# EasyEDA Pro project IOX_77_easyEDA_proj_2026-04-07.epro, board PCB1
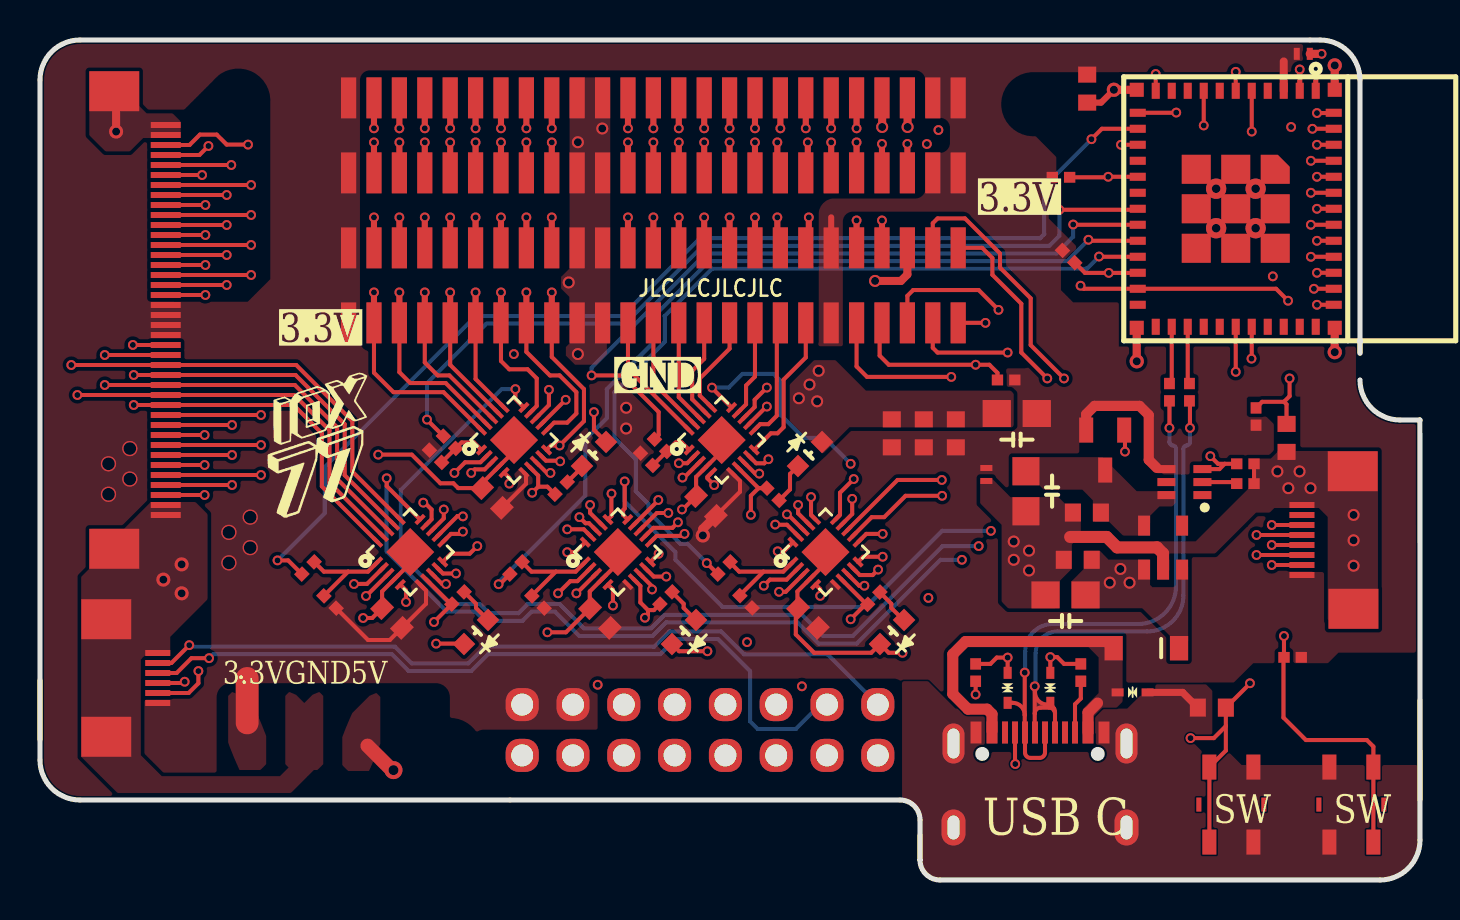
[diagram p1: board, top side]
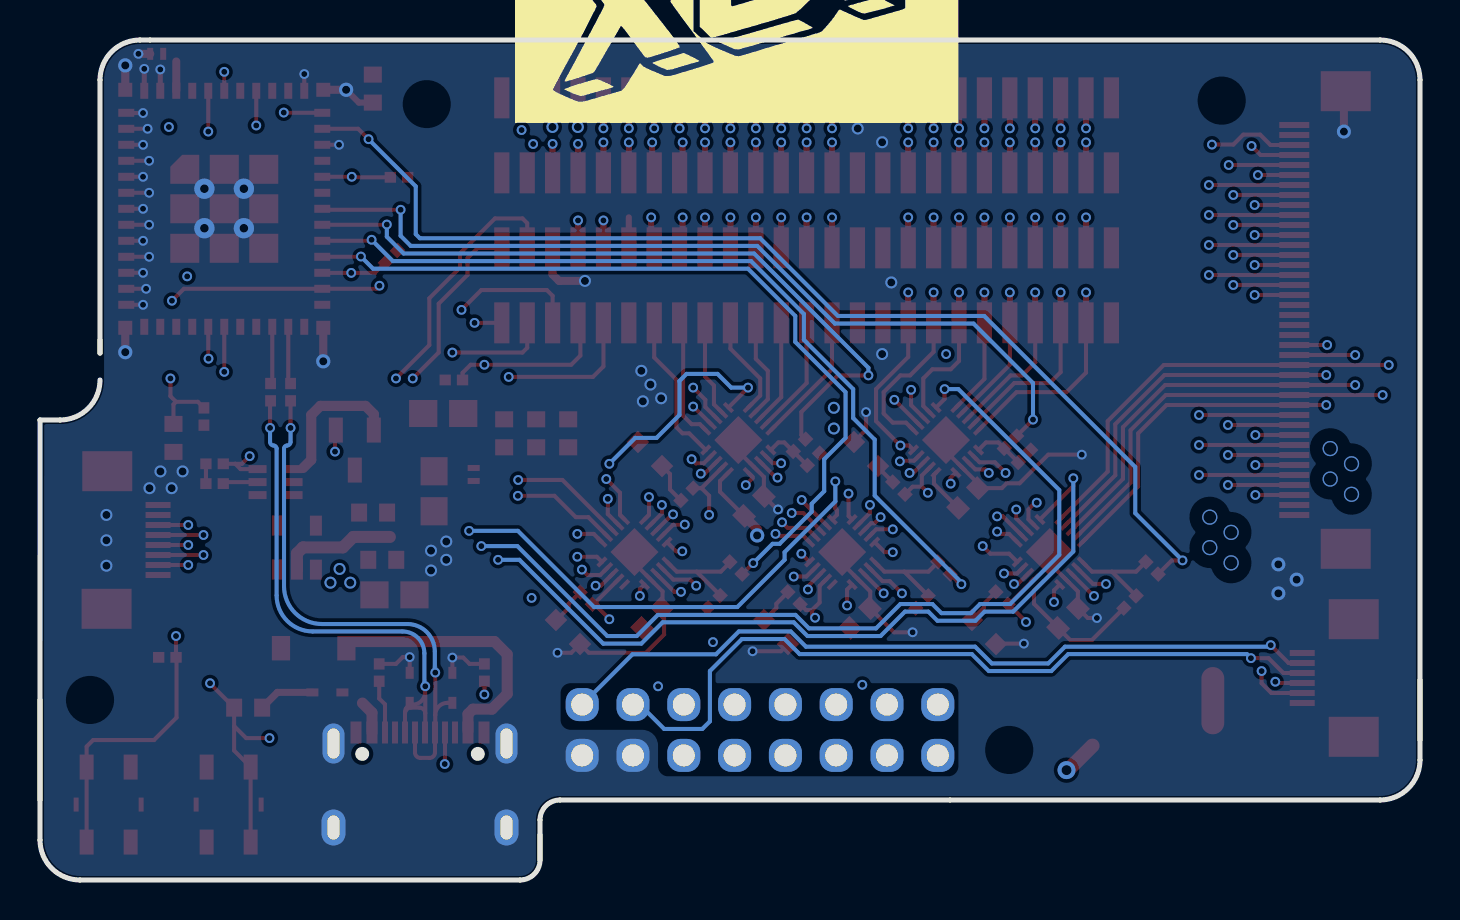
[diagram p2: board, bottom side, seen from below]

Outline 69 x 42 mm; copper layers: Top Layer, Inner1, Inner2, Bottom Layer. Coordinates in mm from the lower left corner of the outline.
Outline path: 0,7 0,10 ; 44,1 44,3 arc(43.71,3.71) 43,4 2,4 arc(0.59,4.59) 0,6 0,40 arc(0.59,41.41) 2,42 64,42 arc(65.41,41.41) 66,40 66,26.35 66,27 ; 44,1 44,2.26 ; 44,1 arc(44.29,0.29) 45,0 67,0 arc(68.41,0.59) 69,2 69,9 ; 66,25 arc(66.59,23.59) 68,23 68.99,23 ; 68.99,23 arc(69,23) 69,22.99 ; 68.99,23 69,4
Stack: Top Layer 0.035mm Outer layer thickness 1oz / Dielectric1 0.2104mm 7628 RC49% 8.6mil / Inner1 0.0152mm Inner layer thickness / Dielectric2 1.065mm 1.1mm H/HOZ Copper / Inner2 0.0152mm Inner layer thickness / Dielectric3 0.2104mm 7628 RC49% 8.6mil / Bottom Layer 0.035mm Outer layer thickness 1oz

## Design rules (mm)
template: Custom Config
spacing copperThickness1oz (default): track to track 0.102, other pairs 0.152 to 0.3
spacing copperThickness2oz: track to track 0.203, other pairs 0.152 to 0.3
track width copperThickness1oz (default): min 0.127, default 0.203, max 2.54
track width copperThickness2oz: min 0.203, default 0.305, max 2.54
differential pair differentialPair (default): width min 0.127, default 0.254, max 2.54; gap min 0.152, default 0.152
via viaSize (default): diameter min 0.45, default 0.49, max 10; hole min 0.3, default 0.3, max 6.3
pour e8095 uses copperRegion2

## Placement (name value [footprint] x y rotation side)
C1  100nF  [0603 CAP clean]  62.33 22.11 270 top
C2  10nF  [0603 CAP clean]  45.79 22.33 90 top
C3  1uF  [0603 CAP clean]  44.19 22.33 90 top
C4  10uF  [C0805]  48.84 23.32 180 top
C5  100nF  [0603 CAP clean]  42.59 22.33 90 top
C20  100nF  [0603 CAP clean]  58.59 8.62 180 top
C22  100nF  [0603 CAP clean]  17.6 13.1 135 top
C23  100nF  [0603 CAP clean]  22.6 19.1 135 top
C24  100nF  [0603 CAP clean]  28 13.1 135 top
C25  100nF  [0603 CAP clean]  38.4 13.1 135 top
C26  100nF  [0603 CAP clean]  33.3 18.7 135 top
C27  100nF  [0603 CAP clean]  51.89 16.01 180 top
C28  10uF  [C0805]  51.28 14.26 180 top
C29  100nF  [0603 CAP clean]  52.34 18.37 180 top
C30  10uF  [C0805]  49.3 19.44 270 top
C31  100nF  [0603 CAP clean]  52.36 39.57 270 top
D1  LESD8D3.3CAT5G  [SOD-882_L1.0-W0.6-BI]  47.32 20.28 90 top
D3  1N5819HW-7-F  [SOD-123_L2.7-W1.6-LS3.7-RD]  55.32 11.59 180 top
D4  LESD8D3.3CAT5G  [SOD-882_L1.0-W0.6-BI]  63.16 41.31 180 top
FPC1  FPC-05F-8PH20  [FPC-SMD_8P-P0.50_FPC-05F-8PH20]  64.38 17 90 top
FPC2  FPC-05F-6PH20  [FPC-SMD_6P-P0.50_XUNPU_FPC-05F-6PH20]  4.6 10.1 270 top
FPC3  FPC-05F-40PH20  [FPC-SMD_40P-P0.50_FPC-05F-40PH20]  5 28 270 top
H3  -  [ESPIO 2x8 clean]  33 7.5 0 top
LED2  XL-1608UOC-06  [ESPIO 0603 LED clean]  21.8 12.4 45 top
LED3  XL-1608UOC-06  [ESPIO 0603 LED clean]  27.7 21.3 225 top
LED4  XL-1608UOC-06  [ESPIO 0603 LED clean]  32.2 12.4 45 top
LED5  XL-1608UOC-06  [ESPIO 0603 LED clean]  42.6 12.4 45 top
LED6  XL-1608UOC-06  [ESPIO 0603 LED clean]  38.5 21.3 225 top
Q14  SI2393DS-T1-GE3  [SOT-23-3_L2.9-W1.3-P1.90-LS2.4-BR]  53.26 21.5 90 top
R4  10K  [R0402]  60.8 23.17 270 top
R5  5.1K  [R0402]  46.78 10.37 270 top
R6  5.1K  [R0402]  52.04 10.37 270 top
R7  22  [R0402]  56.47 24.39 270 top
R8  22  [R0402]  57.47 24.39 270 top
R17  10K  [R0402]  62.63 11.13 0 top
R18  10K  [R0402]  48.31 25 0 top
R19  10K  [R0402]  51.05 35.14 180 top
R20  10K  [R0402]  51.43 31.17 135 top
R24  1K  [R0402]  13.4 15.6 225 top
R25  10K  [R0402]  14.5 13.9 315 top
R26  1K  [R0402]  20.9 14.1 225 top
R27  1K  [R0402]  20.48 21.89 135 top
R28  10K  [R0402]  19.78 21.19 135 top
R29  1K  [R0402]  26.06 19.59 225 top
R30  1K  [R0402]  23.8 15.6 225 top
R31  10K  [R0402]  24.9 13.9 315 top
R32  1K  [R0402]  31.3 14.1 225 top
R33  1K  [R0402]  34.2 15.6 225 top
R34  10K  [R0402]  35.3 13.91 315 top
R35  1K  [R0402]  41.69 14.09 225 top
R36  1K  [R0402]  31.03 21.73 135 top
R37  10K  [R0402]  30.33 21.03 135 top
R38  1K  [R0402]  36.65 19.29 135 top
R44  500K  [R0402]  60.27 20.81 180 top
R45  100K  [R0402]  60.27 19.82 180 top
SW1  TS-1075S-A1B2-D4  [SW-SMD_4P-L3.1-W3.1-P2.20-LS4.0]  59.57 3.77 90 top
SW2  TS-1075S-A1B2-D4  [SW-SMD_4P-L3.1-W3.1-P2.20-LS4.0]  65.57 3.77 90 top
U1  ESP32-C3-MINI-1-N4  [WIFIM-SMD_ESP32-C3-MINI-1]  59.79 33.56 270 top
U2  LESD5D5.0CT1G  [SOD-523_L1.2-W0.8-LS1.6-BI]  54.63 9.38 180 top
U3  LESD5D5.0CT1G  [SOD-523_L1.2-W0.8-LS1.6-BI]  50.52 9.61 270 top
U4  LESD5D5.0CT1G  [SOD-523_L1.2-W0.8-LS1.6-BI]  48.38 9.61 270 top
U8  HC-PM127-4.3H-2x25PS  [HDR-SMD_50P-P1.27-V-F-R2-C25-LS4.8]  30.67 37.23 0 top
U9  HC-PM127-4.3H-2x25PS  [HDR-SMD_50P-P1.27-V-F-R2-C25-LS4.8]  30.67 29.73 0 top
U13  TLV75733PDBVR  [SOT-23-5_L2.9-W1.6-P0.95-LS2.8-BL]  56.15 16.62 0 top
U14  DZDH0401DW-7  [SOT-363_L2.0-W1.3-P0.65-LS2.1-BR]  57.22 19.9 0 top
U.A1  CH32V003F4U6  [QFN-20_L3.0-W3.0-P0.40-TL-EP1.7]  18.51 16.4 45 top
U.A2  CH32V003F4U6  [QFN-20_L3.0-W3.0-P0.40-TL-EP1.7]  23.7 22 45 top
U.A3  CH32V003F4U6  [QFN-20_L3.0-W3.0-P0.40-TL-EP1.7]  28.89 16.4 45 top
U.A4  CH32V003F4U6  [QFN-20_L3.0-W3.0-P0.40-TL-EP1.7]  39.27 16.4 45 top
U.A5  CH32V003F4U6  [QFN-20_L3.0-W3.0-P0.40-TL-EP1.7]  34.08 22 45 top
USB1  TYPE-C 16PIN 2MD(073)  [USB-C-SMD_TYPE-C-6PIN-2MD-073]  50 5 0 top

## Footprints (pads in the part's own frame, mm; a bottom-side part is the same pattern mirrored in y, then rotated)
0603 CAP clean
  rect 0.8x0.9 smd: 1(-0.7,0) 2(0.7,0)
C0805
  rect 1.41x1.35 smd: 1(-1,0) 2(1,0)
ESPIO 2x8 clean
  rrect 1.65x1.65 hole 1.1: 1(-8.89,-1.27) 2(-8.89,1.27) 3(-6.35,-1.27) 4(-6.35,1.27) 5(-3.81,-1.27) 6(-3.81,1.27) 7(-1.27,-1.27) 8(-1.27,1.27) 9(1.27,-1.27) 10(1.27,1.27) 11(3.81,-1.27) 12(3.81,1.27) 13(6.35,-1.27) 14(6.35,1.27) 15(8.89,-1.27) 16(8.89,1.27)
ESPIO 0603 LED clean
  rect 0.8x0.8 smd: 1(0.851,0) 2(-0.851,0)
FPC-SMD_6P-P0.50_XUNPU_FPC-05F-6PH20
  rect 0.3x1.25 smd: 1(-1.25,1.288) 2(-0.75,1.288) 3(-0.25,1.288) 4(0.25,1.288) 5(0.75,1.288) 6(1.25,1.288)
  rect 2x2.5 smd: 7(2.94,-1.288) 8(-2.94,-1.288)
FPC-SMD_8P-P0.50_FPC-05F-8PH20
  rect 0.3x1.25 smd: 1(-1.75,1.288) 2(-1.25,1.288) 3(-0.75,1.288) 4(-0.25,1.288) 5(0.25,1.288) 6(0.75,1.288) 7(1.25,1.288) 8(1.75,1.288)
  rect 2x2.5 smd: 9(3.44,-1.252) 10(-3.44,-1.288)
FPC-SMD_40P-P0.50_FPC-05F-40PH20
  rect 0.3x1.5 smd: 1(-9.75,1.288) 2(-9.25,1.288) 3(-8.75,1.288) 4(-8.25,1.288) 5(-7.75,1.288) 6(-7.25,1.288) 7(-6.75,1.288) 8(-6.25,1.288) 9(-5.75,1.288) 10(-5.25,1.288) 11(-4.75,1.288) 12(-4.25,1.288) 13(-3.75,1.288) 14(-3.25,1.288) 15(-2.75,1.288) 16(-2.25,1.288) 17(-1.75,1.288) 18(-1.25,1.288) 19(-0.75,1.288) 20(-0.25,1.288) 21(0.25,1.288) 22(0.75,1.288) 23(1.25,1.288) 24(1.75,1.288) 25(2.25,1.288) 26(2.75,1.288) 27(3.25,1.288) 28(3.75,1.288) 29(4.25,1.288) 30(4.75,1.288) 31(5.25,1.288) 32(5.75,1.288) 33(6.25,1.288) 34(6.75,1.288) 35(7.25,1.288) 36(7.75,1.288) 37(8.25,1.288) 38(8.75,1.288) 39(9.25,1.288) 40(9.75,1.288)
  rect 2x2.5 smd: 41(11.44,-1.288) 42(-11.44,-1.288)
HDR-SMD_50P-P1.27-V-F-R2-C25-LS4.8
  rect 0.76x2.05 smd: 1(-15.24,-1.875) 2(-15.24,1.875) 3(-13.97,-1.875) 4(-13.97,1.875) 5(-12.7,-1.875) 6(-12.7,1.875) 7(-11.43,-1.875) 8(-11.43,1.875) 9(-10.16,-1.875) 10(-10.16,1.875) 11(-8.89,-1.875) 12(-8.89,1.875) 13(-7.62,-1.875) 14(-7.62,1.875) 15(-6.35,-1.875) 16(-6.35,1.875) 17(-5.08,-1.875) 18(-5.08,1.875) 19(-3.81,-1.875) 20(-3.81,1.875) 21(-2.54,-1.875) 22(-2.54,1.875) 23(-1.27,-1.875) 24(-1.27,1.875) 25(0,-1.875) 26(0,1.875) 27(1.27,-1.875) 28(1.27,1.875) 29(2.54,-1.875) 30(2.54,1.875) 31(3.81,-1.875) 32(3.81,1.875) 33(5.08,-1.875) 34(5.08,1.875) 35(6.35,-1.875) 36(6.35,1.875) 37(7.62,-1.875) 38(7.62,1.875) 39(8.89,-1.875) 40(8.89,1.875) 41(10.16,-1.875) 42(10.16,1.875) 43(11.43,-1.875) 44(11.43,1.875) 45(12.7,-1.875) 46(12.7,1.875) 47(13.97,-1.875) 48(13.97,1.875) 49(15.24,-1.875) 50(15.24,1.875)
QFN-20_L3.0-W3.0-P0.40-TL-EP1.7
  rect 0.6x0.2 smd: 1(-1.5,0.8) 2(-1.5,0.401) 3(-1.5,0) 4(-1.5,-0.4) 5(-1.5,-0.8) 11(1.5,-0.8) 12(1.5,-0.4) 13(1.5,0) 14(1.5,0.401) 15(1.5,0.8)
  rect 0.2x0.6 smd: 6(-0.8,-1.5) 7(-0.4,-1.5) 8(0,-1.5) 9(0.4,-1.5) 10(0.799,-1.5) 16(0.8,1.5) 17(0.4,1.5) 18(0,1.5) 19(-0.4,1.5) 20(-0.8,1.5)
  rect 1.7x1.7 smd: 21(0,0)
R0402
  rect 0.566x0.54 smd: 1(-0.433,0) 2(0.433,0)
SOD-123_L2.7-W1.6-LS3.7-RD
  rect 0.91x1.22 smd: 1(-1.635,0) 2(1.635,0)
SOD-523_L1.2-W0.8-LS1.6-BI
  rect 0.6x0.4 smd: 1(-0.75,0) 2(0.75,0)
SOD-882_L1.0-W0.6-BI
  rect 0.3x0.6 smd: 1(-0.325,0) 2(0.325,0)
SOT-23-3_L2.9-W1.3-P1.90-LS2.4-BR
  rect 1.25x0.7 smd: 1(1,-0.95) 2(1,0.95) 3(-1,0)
SOT-23-5_L2.9-W1.6-P0.95-LS2.8-BL
  rect 0.6x1 smd: 1(-0.95,-1.1) 2(0,-1.1) 3(0.95,-1.1) 4(0.95,1.1) 5(-0.95,1.1)
SOT-363_L2.0-W1.3-P0.65-LS2.1-BR
  rect 0.9x0.4 smd: 1(0.9,-0.65) 2(0.9,0) 3(0.9,0.65) 4(-0.9,0.65) 5(-0.9,0) 6(-0.9,-0.65)
SW-SMD_4P-L3.1-W3.1-P2.20-LS4.0
  rect 1.25x0.7 smd: 1(-1.875,1.1) 2(1.875,1.1) 3(-1.875,-1.1) 4(1.875,-1.1)
  rect 0.7x0.25 smd: 5(0,-1.625) 6(0,1.625)
USB-C-SMD_TYPE-C-6PIN-2MD-073
  rect 0.55x1.1 smd: 1(-3.2,2.375) 2(-2.4,2.375) 11(2.4,2.375) 12(3.2,2.375)
  rect 0.3x1.1 smd: 3(-1.75,2.375) 4(-1.25,2.375) 5(-0.75,2.375) 6(-0.25,2.375) 7(0.25,2.375) 8(0.75,2.375) 9(1.25,2.375) 10(1.75,2.375)
  oval 1.1x2 hole 0.6x1.5: 13(-4.325,1.825) 14(4.325,1.825)
  oval 1.2x1.8 hole 0.6x1.2: 13(-4.325,-2.375) 14(4.325,-2.375)
WIFIM-SMD_ESP32-C3-MINI-1
  rect 0.8x0.4 smd: 1(-5.9,4) 2(-5.9,3.2) 3(-5.9,2.4) 4(-5.9,1.6) 5(-5.9,0.8) 6(-5.9,0) 7(-5.9,-0.8) 8(-5.9,-1.6) 9(-5.9,-2.4) 10(-5.9,-3.2) 11(-5.9,-4) 25(5.9,-4) 26(5.9,-3.2) 27(5.9,-2.4) 28(5.9,-1.6) 29(5.9,-0.8) 30(5.9,0) 31(5.9,0.8) 32(5.9,1.6) 33(5.9,2.4) 34(5.9,3.2) 35(5.9,4)
  rect 0.4x0.8 smd: 12(-4.8,-4.9) 13(-4,-4.9) 14(-3.2,-4.9) 15(-2.4,-4.9) 16(-1.6,-4.9) 17(-0.8,-4.9) 18(0,-4.9) 19(0.8,-4.9) 20(1.6,-4.9) 21(2.4,-4.9) 22(3.2,-4.9) 23(4,-4.9) 24(4.8,-4.9) 36(4.8,4.9) 37(4,4.9) 38(3.2,4.9) 39(2.4,4.9) 40(1.6,4.9) 41(0.8,4.9) 42(0,4.9) 43(-0.8,4.9) 44(-1.6,4.9) 45(-2.4,4.9) 46(-3.2,4.9) 47(-4,4.9) 48(-4.8,4.9)
  custom 1.45x1.45 smd: 49(-1.975,1.975)
  rect 1.45x1.45 smd: 49(-1.975,0) 49(-1.975,-1.975) 49(0,1.975) 49(0,0) 49(0,-1.975) 49(1.975,1.975) 49(1.975,0) 49(1.975,-1.975)
  rect 0.7x0.7 smd: 50(5.95,4.95) 51(5.95,-4.95) 52(-5.95,-4.95) 53(-5.95,4.95)

## Nets
As in the schematic.

Pads without a net: FPC1 7; SW1 5 6; SW2 5 6; U1 4 7 9 10 15 17 24 25 28 29 32 33 34 35; U13 4; U14 1 5; USB1 3 9

## Via types
v1: diameter 0.6, hole 0.4, Top Layer to Bottom Layer, 27 vias
v2: diameter 0.49, hole 0.3, Top Layer to Bottom Layer, 250 vias
v3: diameter 0.7, hole 0.4, Top Layer to Bottom Layer, 4 vias
v4: diameter 1.016, hole 0.432, Top Layer to Bottom Layer, 4 vias
v5: diameter 0.711, hole 0.406, Top Layer to Bottom Layer, 5 vias
v6: diameter 0.762, hole 0.635, Top Layer to Bottom Layer, 8 vias
v7: diameter 0.9, hole 0.5, Top Layer to Bottom Layer, 1 via

## Routing (per net, layer and track width the routed paths; a pad name or vN(x,y) marks a point on that pad's centre or on a via; arc(x,y) is an arc through that point)
+3.3V: length 39.3
  Top Layer w0.203: C23.1 24.3,19.81 24.3,20.27 U.A2.6 ; C26.1 35,19.41 35,19.95 34.58,20.37 ; U.A1.6 19.3,14.48 19.3,13.81 C22.1 17.49,12 16.4,12 R25.2
  Top Layer w0.305: 39.56,33.13 U9.40
  Top Layer w0.4: U1.3 62.19,40.93
  Top Layer w0.457: v5(33.14,17.23) 33.14,17.55 C26.1
  Top Layer w0.508: 55.84,20.6 55.44,21.01 55.44,23.25 54.98,23.71 52.73,23.71 52.31,23.29 Q14.2
  Top Layer w1.143: 10.36,7.86 10.36,10.08
  Inner2 w0.457: 29.43,21.63 31.62,19.44 32.58,19.44 33.14,18.87 v5(33.14,17.23) ; 29.43,21.63 28.95,22.11 ; 29.43,21.63 29.43,23.76 29.18,24.01 28.8,23.63 28.8,22.26 28.95,22.11 ; 28.95,22.11 29.03,22.18 29.03,23.39 29.39,23.75
  vias: v1(29.31,23.61) v1(29.31,22.58) v6(3.42,20.81) v6(3.42,19.29) v6(4.49,21.57) v6(4.49,20.05) v6(9.44,17.38) v6(9.44,15.86) v6(10.51,18.14) v6(10.51,16.62)
+5V: length 109.6
  Top Layer w0.4: v1(43.38,37.65) 43.38,39.1 U8.46 ; v1(42.11,37.65) 42.11,39.1 U8.44
  Top Layer w0.711: v7(17.67,5.49) 17.6,5.49 16.38,6.71
  Inner1 w0.711: v7(17.67,5.49) 18.44,4.72 46.26,4.72 49.98,1 55.92,1 58.59,3.67 58.59,10.22 62.94,14.56 62.94,17.76 62.1,18.6 57.6,18.6 54.48,15.48
  Inner2 w0.4: 44.22,38.49 45.17,38.49 45.64,38.02 45.64,30.49 44.97,29.81 44.97,23.39 v1(53.49,14.87) ; 44.22,38.49 42.95,38.49 ; 44.22,38.49 v1(43.38,37.65) v1(42.11,37.65) ; 42.95,38.49 42.44,38.49 42.11,38.16 v1(42.11,37.65) ; 42.95,38.49 v1(42.11,37.65)
  vias: v1(54.02,15.55) v1(54.48,14.87)
GND: length 83.1
  Top Layer w0.203: C25.2 37.79,13.48 37.79,12.28 38.71,11.36 41.56,11.36 LED5.2 42.44,11.36 v2(43.12,11.36) ; v2(25.37,12.39) 26.3,12.39 C24.2 ; U.A4.21 39.27,15.83 U.A4.4 37.87,14.43 37.87,13.59 ; U.A3.21 28.89,15.83 U.A3.4 27.49,14.43 27.49,13.59 ; U1.40 v2(63.85,31.96) ; LED2.2 21.18,11.82 v2(19.81,11.82) ; v2(27.7,23.4) 27.7,22.51 28.3,21.9 ; v2(63.54,32.76) U1.41 ; v2(16.16,13.1) 16.61,13.1 C22.2 17.1,14.43 U.A1.4 18.51,15.83 U.A1.21 ; v2(32.1,18.53) 32.14,18.53 C26.2 32.81,20.15 U.A5.4 34.08,21.43 U.A5.21 ; LED4.2 31.96,11.44 v2(33.37,11.44) ; v2(63.54,35.96) U1.45 ; v2(63.85,33.56) U1.42 ; R5.1 47.52,10.8 47.84,11.12 v2(48.38,11.12) U4.1 ; R44.1 R45.1 ; v2(63.85,28.76) U1.36 ; v2(63.85,35.16) U1.44 ; 64.69,38.35 v2(63.85,38.35) ; R6.1 51.2,10.8 50.86,11.14 v2(50.52,11.14) U3.1 ; v2(55.79,40.3) U1.11 ; v2(63.85,30.36) U1.38 ; v2(54.05,36.76) U1.14 ; v2(63.54,31.16) U1.39 ; v2(63.54,34.36) U1.43 ; v2(16.91,21.27) 18.59,21.27 20.02,19.83 20.67,19.83 20.91,19.59 C23.2 22.1,19.84 U.A2.4 23.7,21.43 U.A2.21 ; v2(63.62,37.56) U1.47 ; v2(63.85,36.76) U1.46 ; v2(63.7,29.56) U1.37
  Top Layer w0.254: v2(62.99,40.53) U1.2 ; v2(63.79,40.56) U1.1
  Top Layer w0.305: 52.44,38.87 53.05,38.87 v5(53.69,39.51)
  Top Layer w0.355: C20.2 57.13,9.38 U2.1
  Top Layer w0.4: U9.46 43.37,30.28 43.05,29.95 v1(41.75,29.95) ; FPC3.42 3.81,39.35 v3(3.81,37.42)
  Top Layer w0.406: v5(64.74,26.39) U1.50 ; v5(64.74,40.73) U1.53 ; v5(53.69,39.51) U1.52 ; v2(64.08,41.31) 63.49,41.31 ; v5(54.84,25.93) U1.51
  Top Layer w0.6: U13.2 56.15,16.33 55.85,16.63 53.86,16.63 53.34,17.15 51.51,17.15
  vias: v1(26.44,29.88) v1(26.89,36.89) v1(26.89,26.3) v1(28.11,37.57) v1(37.94,24.09) v1(38.48,24.77) v1(38.86,23.93) v1(38.93,25.46) v1(48.69,16.92) v1(48.69,16.01) v1(49.45,16.47) v1(49.45,15.48) v1(61.87,20.43) v1(62.42,19.59) v1(62.98,20.43) v1(63.53,19.59) v1(65.68,18.25) v1(65.68,16.98) v1(65.68,15.71) v3(6.17,15.02) v3(7.08,15.78) v3(7.08,14.33) v4(58.81,34.56) v4(58.81,32.59) v4(60.78,34.56) v4(60.78,32.59)
VBUS_USB: length 15.3
  Top Layer w0.551: D3.2 53.35,11.92 46.28,11.92 45.64,11.29 45.64,9.3 46.4,8.54 47.35,8.54 47.6,8.3 47.6,7.45 ; 52.88,8.85 52.4,8.37 52.4,7.38
A.A0: length 49.5
  Top Layer w0.203: FPC3.37 v2(9.6,19.75) ; v2(16.3,14.2) 16.31,14.2 U.A1.3
  Top Layer w0.305: v2(25.59,36.88) U8.17
  Inner1 w0.203: v2(16.3,14.2) 16.3,15.02 14.32,17 14.32,32.24 16.15,34.07 24.46,34.07 25.59,35.2 v2(25.59,36.88)
  Inner2 w0.203: v2(16.3,14.2) 16.3,15.86 12.41,19.75 v2(9.6,19.75)
A.A1: length 46.4
  Top Layer w0.203: U.A1.2 16.35,14.8 15.99,14.8 15.99,14.8 v2(15.7,14.8) ; FPC3.38 v2(8.23,19.25)
  Top Layer w0.305: v2(24.32,36.88) U8.15
  Inner1 w0.203: v2(8.23,19.25) 12.23,19.25 13.94,20.96 13.94,32.47 15.92,34.45 23.69,34.45 24.32,35.08 v2(24.32,36.88)
  Inner2 w0.203: v2(8.23,19.25) 12.38,19.25 15.7,15.93 v2(15.7,14.8)
A.A2: length 43.6
  Top Layer w0.203: FPC3.33 v2(11.05,21.75) ; U.A1.11 20.55,17.31 21.03,17.31 v2(21.14,17.42)
  Top Layer w0.305: v2(23.05,36.88) U8.13
  Inner1 w0.203: v2(23.05,36.88) 23.05,35.71 22.17,34.83 15.69,34.83 13.56,32.7 13.56,24.26 v2(11.05,21.75)
  Inner2 w0.203: v2(11.05,21.75) 12.77,21.75 17.44,17.08 20.8,17.08 v2(21.14,17.42)
A.A3: length 62.4
  Top Layer w0.203: v2(1.56,25.75) FPC3.25 12.81,25.75 15.62,22.94 15.62,20.42 18.01,18.02
  Top Layer w0.305: v2(25.59,37.58) U8.18
  Inner1 w0.203: v2(25.59,37.58) 25.59,39.87 24.91,40.55 4.42,40.55 1.9,38.03 1.9,26.09 v2(1.56,25.75)
A.A4: length 39.2
  Top Layer w0.203: U.A1.17 15.23,20.24 15.24,22.79 12.78,25.25 FPC3.26 v2(4.69,25.25)
  Top Layer w0.305: v2(16.7,36.88) U8.3
  Inner1 w0.203: v2(16.7,36.88) 14.69,36.88 11.65,33.84 11.65,28.35 8.55,25.25 v2(4.69,25.25)
A.A5: length 61
  Top Layer w0.203: v2(1.87,24.25) FPC3.28 12.71,24.25 14.47,22.49 14.47,19.87 U.A1.19
  Top Layer w0.305: v2(24.32,37.58) U8.16
  Inner1 w0.203: v2(24.32,37.58) 24.32,39.16 23.31,40.17 13.56,40.17 11.04,37.65 8.99,37.65 7.77,38.87 3.35,38.87 2.28,37.8 2.28,24.66 v2(1.87,24.25)
A.A6: length 40.2
  Top Layer w0.203: v2(4.69,23.75) FPC3.29 12.68,23.75 14.09,22.33 14.09,19.68 U.A1.20
  Top Layer w0.305: v2(17.97,36.88) U8.5
  Inner1 w0.203: v2(4.69,23.75) 7.96,23.75 12.03,27.82 12.03,33.61 14.78,36.36 17.44,36.36 v2(17.97,36.88)
A.A7: length 57.5
  Top Layer w0.203: U.A1.18 14.85,20.05 14.85,22.64 12.74,24.75 FPC3.27 v2(3.24,24.75)
  Top Layer w0.305: v2(23.05,37.58) U8.14
  Inner1 w0.203: v2(23.05,37.58) 23.05,39.13 22.4,39.78 13.79,39.78 11.27,37.27 8.76,37.27 7.54,38.49 3.58,38.49 2.66,37.57 2.66,25.33 v2(3.24,24.75)
A.NRST: length 56.2
  Top Layer w0.203: U1.13 53.09,37.56 v2(52.57,37.04) ; v2(11.88,15.98) 12.41,15.98 13.09,15.29
  Bottom Layer w0.203: v2(11.88,15.98) 14.24,18.34 14.24,20.65 21.79,28.2 29.1,28.2 32.99,32.09 50.01,32.09 50.21,32.29 50.21,34.68 v2(52.57,37.04)
A.PC0: length 44.3
  Top Layer w0.203: v2(19.7,12.9) 20.59,13.79 ; U.A1.7 20.55,13.79 ; FPC3.35 v2(8.23,20.75)
  Top Layer w0.305: v2(19.24,36.88) U8.7
  Inner1 w0.203: v2(19.24,36.88) 18.33,35.97 15.01,35.97 12.42,33.38 12.42,27.06 8.91,23.55 8.91,21.35 8.31,20.75 v2(8.23,20.75)
  Inner2 w0.203: v2(8.23,20.75) 12.55,20.75 19.12,14.18 19.12,13.48 v2(19.7,12.9)
A.PC3: length 43.9
  Top Layer w0.203: v2(21.86,16.7) 21.48,16.31 20.55,16.31 U.A1.10 ; FPC3.34 v2(9.6,21.25)
  Top Layer w0.305: v2(20.51,36.88) U8.9
  Inner1 w0.203: v2(9.6,21.25) 10.21,21.85 10.21,23.78 12.8,26.37 12.8,33.15 15.23,35.59 19.89,35.59 20.51,36.21 v2(20.51,36.88)
  Inner2 w0.203: v2(21.86,16.7) 17.22,16.7 12.66,21.25 v2(9.6,21.25)
A.PC5.FT: length 83.9
  Top Layer w0.203: v2(21.14,18.18) 21.13,18.2 20.87,18.2 19.85,17.18 ; FPC3.32 v2(8.23,22.25)
  Top Layer w0.305: v2(35.75,37.58) U8.34
  Inner2 w0.203: v2(21.14,18.18) 20.9,18.18 20.18,17.46 17.67,17.46 12.88,22.25 v2(8.23,22.25) 1.6,22.25 0.53,23.32 0.53,39.78 2.2,41.46 34.28,41.46 35.75,40 v2(35.75,37.58)
A.PC6.FT: length 80.9
  Top Layer w0.203: v2(20.19,18.52) 20.19,18.08 U.A1.13 ; FPC3.31 v2(9.6,22.75)
  Top Layer w0.305: v2(34.48,37.58) U8.32
  Inner2 w0.203: v2(20.19,18.52) 19.5,17.84 17.9,17.84 12.99,22.75 v2(9.6,22.75) 2.02,22.75 0.99,23.78 0.99,39.71 2.36,41.08 33.37,41.08 34.48,39.97 v2(34.48,37.58)
A.PC7: length 39.1
  Top Layer w0.203: v2(11.05,23.25) FPC3.30 ; v2(19.16,18.87) 19.24,18.87 19.58,18.52 19.58,18.03 19.29,17.74
  Top Layer w0.305: v2(21.78,36.88) U8.11
  Inner1 w0.203: v2(11.05,23.25) 13.18,25.38 13.18,32.93 15.46,35.21 21.1,35.21 21.78,35.89 v2(21.78,36.88)
  Inner2 w0.203: v2(19.16,18.87) 17.48,18.87 13.1,23.25 v2(11.05,23.25)
A.PD0: length 53.8
  Top Layer w0.203: v2(18.3,13.9) 18.3,14.48 U.A1.5 ; FPC3.36 v2(11.05,20.25)
  Top Layer w0.305: v2(29.4,36.88) U8.23
  Inner1 w0.203: v2(29.4,36.88) 28.49,36.88 25.29,33.69 16.38,33.69 14.7,32.01 14.7,17.5 v2(18.3,13.9)
  Inner2 w0.203: v2(11.05,20.25) 12.47,20.25 18.3,14.42 v2(18.3,13.9)
A.SWIO: length 60.4
  Top Layer w0.203: U.A1.15 17.33,19.69 v2(17.33,20.09) ; v2(61.59,16.75) 62.96,16.75
  Inner1 w0.203: v2(46.1,16.01) 48.76,13.34 58.67,13.34 59.58,14.26 59.58,16.31 60.02,16.75 v2(61.59,16.75)
  Bottom Layer w0.203: v2(46.1,16.01) 45.03,16.01 40.84,11.82 38.93,11.82 37.87,12.89 31.31,12.89 30.63,12.2 26.97,12.2 25.75,13.42 24.58,13.42 24.13,12.96 22.23,12.96 21.77,13.42 20.34,13.42 17.33,16.42 v2(17.33,20.09)
B.A0: length 49.1
  Top Layer w0.203: FPC3.6 v2(8.1,35.25) ; U.A2.3 22.23,20.53 21.74,20.53 v2(21.56,20.35)
  Top Layer w0.305: v2(20.51,37.58) U8.10
  Inner1 w0.203: v2(20.51,37.58) 20.51,38.32 19.81,39.02 14.24,39.02 10.47,35.25 8.82,35.25 8.82,35.25 v2(8.1,35.25)
  Inner2 w0.203: v2(8.1,35.25) 7.35,35.25 5.86,33.76 5.86,28.43 8,26.3 19.43,26.3 21.56,24.16 v2(21.56,20.35)
B.A1: length 53.7
  Top Layer w0.203: U.A2.2 22.02,20.89 21.25,20.89 v2(20.72,20.35) ; v2(9.56,35.75) FPC3.5
  Top Layer w0.305: v2(21.78,37.58) U8.12
  Inner1 w0.203: v2(21.78,37.58) 21.79,37.59 21.79,38.72 21.1,39.4 14.02,39.4 10.36,35.75 v2(9.56,35.75)
  Inner2 w0.203: v2(9.56,35.75) 8.83,35.75 8.38,36.2 7.16,36.2 5.48,34.53 5.48,28.28 7.84,25.92 18.59,25.92 20.72,23.78 v2(20.72,20.35)
B.A2: length 29.9
  Top Layer w0.203: U9.15 24.32,26.41 25.5,25.23 25.98,25.23 26.82,24.39 26.82,23.32 26.36,22.87 25.7,22.87 U.A2.11 ; FPC3.10 v2(10.56,33.25)
  Top Layer w0.305: U9.15 v2(24.32,29.38)
  Inner2 w0.203: v2(10.56,33.25) 13.23,33.25 14.24,32.24 23.31,32.24 24.32,31.23 v2(24.32,29.38)
B.A3: length 23.7
  Top Layer w0.203: 23.21,23.62 21.78,25.05 U9.11 ; FPC3.12 v2(8.27,32.25)
  Top Layer w0.305: v2(21.78,29.38) U9.11
  Inner2 w0.203: v2(8.27,32.25) 13.17,32.25 13.94,31.48 20.87,31.48 21.78,30.57 v2(21.78,29.38)
B.A4: length 22.5
  Top Layer w0.203: U.A2.17 20.51,25.75 U9.9 ; FPC3.13 v2(10.56,31.75)
  Top Layer w0.305: U9.9 v2(20.51,29.38)
  Inner2 w0.203: v2(20.51,29.38) 20.51,29.86 19.35,31.02 13.86,31.02 13.13,31.75 v2(10.56,31.75)
B.A5: length 21.7
  Top Layer w0.203: FPC3.15 v2(8.27,30.75) ; U9.5 17.97,25.39 18.51,24.85 20.28,24.85 U.A2.19
  Top Layer w0.305: U9.5 v2(17.97,29.38)
  Inner2 w0.203: v2(8.27,30.75) 13.07,30.75 13.71,30.11 17.24,30.11 v2(17.97,29.38)
B.A6: length 21.4
  Top Layer w0.203: 22.07,22.49 20.18,24.39 17.67,24.39 16.7,25.37 U9.3 ; FPC3.16 v2(10.56,30.25)
  Top Layer w0.305: U9.3 v2(16.7,29.38)
  Inner2 w0.203: v2(16.7,29.38) 13.9,29.38 13.03,30.25 v2(10.56,30.25)
B.A7: length 22.1
  Top Layer w0.203: U.A2.18 20.47,25.23 19.88,25.23 19.24,25.87 U9.7 ; FPC3.14 v2(9.34,31.25)
  Top Layer w0.305: U9.7 v2(19.24,29.38)
  Inner2 w0.203: v2(19.24,29.38) 19.24,29.84 18.51,30.56 13.79,30.56 13.1,31.25 v2(9.34,31.25)
B.NRST: length 42.9
  Top Layer w0.203: v2(50.97,33.51) 54.84,33.51 U1.18 ; R27.2 19.35,23.01 v2(19.35,23.02)
  Bottom Layer w0.203: v2(19.35,23.02) 19.35,24.85 22.32,27.82 29.26,27.82 33.14,31.71 50.47,31.71 50.97,32.21 v2(50.97,33.51)
B.PC0: length 49.2
  Top Layer w0.203: R29.2 25.37,19.66 24.91,19.66 ; 24.91,19.66 24.91,20.22 24.48,20.65 ; 24.91,19.66 v2(24.61,19.36) ; v2(9.34,34.25) FPC3.8
  Top Layer w0.305: v2(17.97,37.58) U8.6
  Inner1 w0.203: v2(9.34,34.25) 10.84,34.25 14.85,38.26 17.29,38.26 v2(17.97,37.58)
  Inner2 w0.203: v2(24.61,19.36) 24.15,19.82 24.15,23.17 20.26,27.06 8.3,27.06 6.62,28.73 6.62,33.23 7.64,34.25 v2(9.33,34.25)
B.PC3: length 9.6
  Top Layer w0.203: 25.33,21.5 25.55,21.72 v2(25.98,21.72) 27.2,22.94 27.2,24.54 25.59,26.15 U9.17
  Top Layer w0.305: v2(25.59,29.38) U9.17
B.PC5.FT: length 76.7
  Top Layer w0.203: v2(26.28,24.01) 26.28,24.01 U.A2.12 ; v2(10.4,36.77) 9.33,36.77 8.83,37.27 8,37.27 7.48,36.75 FPC3.3
  Top Layer w0.305: v2(30.67,37.58) U8.26
  Inner2 w0.203: v2(26.28,24.01) 26.66,23.63 26.66,20.66 24.38,18.37 22.93,18.37 21.48,19.82 20.42,19.82 18.36,21.88 18.36,24.47 17.29,25.53 7.69,25.53 5.1,28.13 5.1,35.67 6.68,37.25 8.86,37.25 9.33,36.77 v2(10.4,36.77) 12.07,36.77 15.16,39.86 30.25,39.86 30.67,39.44 v2(30.67,37.58)
B.PC6.FT: length 61.5
  Top Layer w0.203: FPC3.4 7.97,36.25 v2(8.42,36.7) ; U.A2.13 25.45,23.74 v2(25.45,24.51)
  Top Layer w0.305: v2(29.4,37.58) U8.24
  Inner2 w0.203: v2(25.45,24.51) 25.45,27.36 24.84,27.97 12.11,27.97 11.73,28.35 8.05,28.35 7.39,29.01 7.39,32.62 8.01,33.25 9.08,33.25 9.6,33.76 10.89,33.76 11.23,34.11 11.23,35.23 ; 11.23,35.23 15.48,39.48 28.8,39.48 29.4,38.88 v2(29.4,37.58) ; 11.23,35.23 10.96,35.51 10.57,35.51 10.36,35.71 10.36,36.1 10.19,36.28 9.22,36.28 8.79,36.7 v2(8.42,36.7)
B.PC7: length 26.4
  Top Layer w0.203: U9.13 23.05,25.95 23.47,25.53 24.38,25.53 24.84,25.08 24.84,23.7 24.48,23.34 ; v2(9.34,32.75) FPC3.11
  Top Layer w0.305: v2(23.05,29.38) U9.13
  Inner2 w0.203: v2(23.05,29.38) 23.05,30.75 21.94,31.86 14.09,31.86 13.2,32.75 v2(9.34,32.75)
B.PD0: length 49.7
  Top Layer w0.203: v2(23.47,19.82) 23.47,20.11 U.A2.5 ; FPC3.7 v2(10.56,34.75)
  Top Layer w0.305: v2(19.24,37.58) U8.8
  Inner1 w0.203: v2(10.56,34.75) 14.45,38.64 18.18,38.64 v2(19.24,37.58)
  Inner2 w0.203: v2(23.47,19.82) 23.47,23.02 19.81,26.68 8.15,26.68 6.24,28.58 6.24,33.54 7.46,34.75 10.55,34.75
B.SWIO: length 65.9
  Top Layer w0.203: v2(60.83,17.25) 62.96,17.25 ; v2(23.77,24.54) 23.77,24.05 U.A2.15
  Inner1 w0.203: v2(46.93,16.7) 46.93,15.96 49.16,13.74 58.53,13.74 59.2,14.41 59.2,16.47 59.99,17.25 v2(60.83,17.25)
  Bottom Layer w0.203: v2(23.77,24.54) 23.08,24.54 18.04,19.5 18.04,16.26 20.49,13.8 22,13.8 22.45,13.34 23.93,13.34 24.38,13.8 25.98,13.8 27.2,12.58 30.55,12.58 31.23,13.26 38.11,13.26 39.16,12.2 40.64,12.2 45.13,16.7 v2(46.93,16.7)
C.A0: length 67.2
  Top Layer w0.203: U.A3.3 26.83,14.33 v2(26.82,14.33) ; FPC3.17 v2(9.34,29.75)
  Top Layer w0.305: v2(30.67,36.88) U8.25
  Inner1 w0.203: v2(30.67,36.88) 30.67,35.91 30.04,35.29 30.04,31.5 29.64,31.1 29.64,25.61 28.26,24.23 27.65,24.23 27.2,23.78 27.2,23.1 27.5,22.79 27.5,20.35 25.29,18.14 25.29,15.86 v2(26.82,14.33)
  Inner2 w0.203: v2(26.82,14.33) 25.22,15.93 25.22,17.53 28.2,20.51 28.2,23.95 28.57,24.32 28.57,27.21 27.08,28.7 12.45,28.7 11.4,29.75 v2(9.34,29.75)
C.A1: length 62.8
  Top Layer w0.203: U.A3.2 26.87,14.94 26.51,14.94 v2(25.9,14.33) ; FPC3.18 v2(8.27,29.25)
  Top Layer w0.305: v2(29.4,33.13) U9.24
  Inner1 w0.203: v2(29.4,33.13) 29.4,31.39 29.26,31.25 29.26,25.76 28.14,24.64 27.37,24.64 26.82,24.09 26.82,22.87 27.12,22.56 27.12,20.51 24.91,18.3 24.91,15.32 v2(25.9,14.33)
  Inner2 w0.203: v2(8.27,29.25) 11.37,29.25 12.26,28.35 26.82,28.35 28.19,26.98 28.19,24.77 27.05,23.63 27.05,20.43 24.84,18.22 24.84,15.4 v2(25.9,14.33)
C.A2: length 20.7
  Top Layer w0.203: v2(32.22,17.31) 32.12,17.2 30.83,17.2 30.52,16.89
  Top Layer w0.305: v2(35.75,33.13) U9.34
  Inner1 w0.203: v2(35.75,33.13) 35.75,29.59 34.21,28.05 34.21,19.29 v2(32.22,17.31)
C.A3: length 21.8
  Top Layer w0.203: 28.4,18.02 28.57,18.2 28.57,19.32 v2(28.57,19.32)
  Top Layer w0.305: v2(31.94,36.88) U8.27
  Inner1 w0.203: v2(28.57,19.32) 28.57,20.36 30.4,22.18 30.4,30.79 31.31,31.71 31.31,34.89 31.94,35.52 v2(31.94,36.88)
C.A4: length 18.5
  Top Layer w0.203: U.A3.17 27.5,18.35 v2(27.5,18.75)
  Top Layer w0.305: v2(30.67,33.13) U9.26
  Inner1 w0.203: v2(30.67,33.13) 30.67,31.6 30.02,30.94 30.02,22.33 27.5,19.82 v2(27.5,18.75)
C.A5: length 26.1
  Top Layer w0.203: U.A3.19 27.19,17.53 v2(26.36,17.53)
  Top Layer w0.305: v2(33.21,36.88) U8.29
  Inner1 w0.203: v2(33.21,36.88) 33.21,35.59 32.55,34.93 32.55,31.88 31.16,30.49 31.16,21.88 30.4,21.12 30.4,19.82 28.11,17.53 v2(26.36,17.53)
C.A6: length 22.9
  Top Layer w0.203: U.A3.20 26.76,16.39 v2(26.36,16.39)
  Top Layer w0.305: v2(33.21,33.13) U9.30
  Inner1 w0.203: v2(26.36,16.39) 27.5,16.39 30.78,19.67 30.78,20.96 31.54,21.72 31.54,30.34 33.21,32 v2(33.21,33.13)
C.A7: length 20.4
  Top Layer w0.203: v2(26.97,18.14) 27.28,17.84 27.45,17.84 U.A3.18
  Top Layer w0.305: v2(31.94,33.13) U9.28
  Inner1 w0.203: v2(26.97,18.14) 28.19,18.14 30.02,19.97 30.02,21.27 30.78,22.03 30.78,30.64 31.94,31.8 v2(31.94,33.13)
C.NRST: length 43.2
  Top Layer w0.203: U1.20 52.47,31.96 v2(52.42,32.01) ; v2(22.93,14.79) 22.99,14.79 23.49,15.29
  Bottom Layer w0.203: v2(52.42,32.01) 51.35,30.94 33.45,30.94 30.81,28.3 30.81,27.01 28.34,24.54 28.34,23.1 27.26,22.02 27.26,19.22 22.93,14.89 v2(22.93,14.79)
C.PC0: length 31.9
  Top Layer w0.203: 30.4,13.5 30.69,13.5 30.99,13.79 ; 30.4,13.5 30.4,13.27 v2(30.25,13.11) ; 30.4,13.5 30.02,13.88 30.02,14.71 U.A3.7
  Top Layer w0.305: U8.35 36.87,35.51 v2(36.87,36.88)
  Inner1 w0.203: v2(36.87,36.88) 36.87,35.2 36.29,34.63 36.29,29.6 34.59,27.9 34.59,16.16 33.62,15.19 32.32,15.19 v2(30.25,13.11)
C.PC3: length 61.6
  Top Layer w0.203: v2(30.93,16.31) 30.93,16.31 U.A3.10 ; FPC3.9 v2(8.27,33.75)
  Top Layer w0.305: v2(16.7,37.58) U8.4
  Inner1 w0.203: v2(23.69,26.3) 22.63,25.23 22.63,23.78 23.16,23.25 25.83,23.25 26.74,22.33 26.74,20.66 24.53,18.45 24.53,14.56 25.45,13.65 27.05,13.65 29.71,16.31 v2(30.93,16.31) ; v2(8.27,33.75) 10.95,33.75 14.79,37.58 v2(16.7,37.58)
  Inner2 w0.203: v2(8.27,33.75) 7.83,33.75 7.01,32.93 7.01,28.89 8.3,27.59 22.32,27.59 23.54,26.37
C.PC5.FT: length 89.9
  Top Layer w0.203: v2(3.24,26.25) FPC3.24 ; U.A3.12 30.67,17.61 31.62,17.61 v2(31.9,17.89)
  Top Layer w0.305: v2(33.21,37.58) U8.30
  Inner2 w0.203: v2(31.9,17.89) 31.86,17.85 29.88,17.85 27.81,15.78 27.81,13.95 27.28,13.42 25.14,13.42 23.85,14.71 23.85,16.31 21.1,19.06 20.11,19.06 17.6,21.57 17.6,24.16 16.99,24.77 7.39,24.77 6.24,25.92 3.57,25.92 v2(3.24,26.25) 3.24,35.48 8.45,40.7 32.38,40.7 33.21,39.87 v2(33.21,37.58)
C.PC6.FT: length 84
  Top Layer w0.203: 29.95,17.46 30.84,18.35 v2(31.41,18.35) ; FPC3.23 4.65,26.75 v2(4.64,26.75)
  Top Layer w0.305: v2(31.94,37.58) U8.28
  Inner2 w0.203: v2(31.94,37.58) 31.94,39.69 31.31,40.32 8.99,40.32 3.69,35.02 3.69,27.7 v2(4.64,26.75) 5.94,26.75 7.54,25.15 17.14,25.15 17.98,24.32 17.98,21.72 20.27,19.44 21.31,19.44 24.24,16.51 24.24,14.85 25.29,13.8 27.05,13.8 27.41,14.17 27.41,15.84 29.92,18.35 v2(31.41,18.35)
C.PC7: length 23.8
  Top Layer w0.203: v2(30.91,19) 30.91,18.99 U.A3.14
  Top Layer w0.305: v2(35.75,36.88) U8.33
  Inner1 w0.203: v2(30.91,19) 31.94,19 33.07,20.12 33.07,30.26 35.13,32.32 35.13,34.76 35.75,35.38 v2(35.75,36.88)
C.PD0: length 29.5
  Top Layer w0.203: v2(28.65,13.72) 28.65,14.52 U.A3.5
  Top Layer w0.305: U9.36 36.87,31.76 v2(36.87,33.13)
  Inner1 w0.203: v2(28.65,13.72) 28.65,12.96 29.26,12.35 30.32,12.35 32.46,14.49 33.53,14.49 34.97,15.93 34.97,27.74 36.87,29.64 v2(36.87,33.13)
C.SWIO: length 45.7
  Top Layer w0.203: v2(61.59,17.75) 62.96,17.75 ; v2(29.23,19.93) 29.23,18.58 29.15,18.5 29.15,18.26 U.A3.15
  Inner1 w0.203: v2(47.54,17.46) 47.54,15.93 49.37,14.1 58.36,14.1 58.82,14.56 58.82,16.62 59.95,17.75 v2(61.59,17.75)
  Bottom Layer w0.203: v2(47.54,17.46) 45.11,17.46 41.3,13.65 34.13,13.65 31.77,16.01 31.77,16.39 29.23,18.93 v2(29.23,19.93)
CC1: length 7
  Top Layer w0.203: v2(46.78,9.28) R5.2 ; v2(48.76,5.8) 48.75,5.81 USB1.4
  Inner2 w0.203: v2(46.78,9.28) 47.65,9.28 48.76,8.16 v2(48.76,5.8)
CC2: length 2.7
  Top Layer w0.203: R6.2 52.04,9.08 51.75,8.79 USB1.10
D.A0: length 38.5
  Top Layer w0.203: v2(36.95,14.41) 37.29,14.41 38.21,15.34
  Top Layer w0.305: v2(38.39,36.88) 38.39,35.46 U8.37
  Inner2 w0.203: H3.8 33.18,10.22 35.12,10.22 36.95,12.05 v2(36.95,14.41) 37.33,14.41 42.06,19.13 42.06,28.73 39.01,31.78 39.01,33.61 38.39,34.23 v2(38.39,36.88)
D.A1: length 37.4
  Top Layer w0.203: U.A4.2 37.33,15.02 36.5,15.02 v2(36.19,14.71)
  Top Layer w0.305: v2(38.44,33.13) 38.44,31.76 U9.38
  Inner2 w0.203: v2(38.44,33.13) 38.44,31.82 41.68,28.58 41.68,19.29 37.56,15.17 36.65,15.17 v2(36.19,14.71) 36.19,11.82 34.97,10.6 31.02,10.6 H3.6
D.A2: length 23.2
  Top Layer w0.203: U.A4.11 41.31,17.31 v2(42.13,17.31)
  Top Layer w0.305: v2(42.1,36.81) U8.43
  Inner2 w0.203: v2(42.1,36.81) 42.1,34.87 42.67,34.3 42.67,31.02 43.2,30.49 43.2,18.37 v2(42.13,17.31)
D.A3: length 41.6
  Top Layer w0.203: v2(38.55,19.15) 38.55,18.25 38.78,18.02
  Top Layer w0.305: v2(17.97,33.13) U9.6
  Inner2 w0.203: v2(17.97,33.13) 17.97,34.82 18.59,35.44 26.74,35.44 28.36,33.82 28.36,32.3 28.8,31.86 37.33,31.86 40.91,28.28 40.91,22.33 38.55,19.97 v2(38.55,19.15)
D.A4: length 39.9
  Top Layer w0.203: U.A4.17 37.91,18.33 v2(37.91,18.75)
  Top Layer w0.305: v2(19.24,33.13) U9.8
  Inner2 w0.203: v2(19.24,33.13) 19.24,34.49 19.81,35.06 26.59,35.06 27.98,33.67 27.98,32.15 28.65,31.48 37.18,31.48 40.53,28.13 40.53,22.49 37.91,19.86 v2(37.91,18.75)
D.A5: length 30.3
  Top Layer w0.203: v2(36.76,17.77) 36.77,17.76 37.34,17.76 U.A4.19
  Top Layer w0.305: v2(21.78,33.13) U9.12
  Inner2 w0.203: v2(21.78,33.13) 21.78,33.91 22.17,34.3 26.28,34.3 27.2,33.38 27.2,31.86 28.34,30.72 30.17,30.72 31.24,29.65 31.24,24.16 36.76,18.64 v2(36.76,17.77)
D.A6: length 28.9
  Top Layer w0.203: 37.65,16.89 37.19,16.44 v2(36.89,16.44)
  Top Layer w0.305: v2(23.05,33.13) U9.14
  Inner2 w0.203: v2(23.05,33.13) 23.83,33.92 26.13,33.92 26.82,33.23 26.82,31.71 28.19,30.34 30.02,30.34 30.86,29.5 30.86,24.01 36.26,18.6 36.26,17.54 36.89,16.91 v2(36.89,16.44)
D.A7: length 38.2
  Top Layer w0.203: 38.21,17.46 37.39,18.28 v2(37.35,18.28)
  Top Layer w0.305: v2(20.51,33.13) U9.10
  Inner2 w0.203: v2(37.35,18.28) 37.35,19.83 40.15,22.64 40.15,27.97 37.03,31.1 28.49,31.1 27.58,32.01 27.58,33.54 26.44,34.68 20.95,34.68 20.51,34.24 v2(20.51,33.13)
D.NRST: length 41.2
  Top Layer w0.203: v2(52.95,31.17) 52.97,31.16 U1.21 ; 33.89,15.29 33.34,15.84 v2(33.34,15.84)
  Bottom Layer w0.203: v2(52.95,31.17) 52.34,30.56 33.6,30.56 31.24,28.2 31.24,26.91 28.72,24.39 28.72,22.11 29.79,21.04 29.79,19.44 30.42,18.81 30.42,18.41 32.02,16.81 32.37,16.81 v2(33.34,15.84)
D.PC0: length 30.1
  Top Layer w0.203: v2(40.53,13.04) 41.28,13.78 41.38,13.78 ; 40.05,15.05 41.31,13.79
  Top Layer w0.305: v2(40.83,36.88) U8.41
  Inner2 w0.203: v2(40.53,13.04) 40.53,16.54 42.82,18.83 42.82,30.34 41.45,31.71 41.45,33.92 40.83,34.54 v2(40.83,36.88)
D.PC3: length 24.4
  Top Layer w0.203: U.A4.10 41.16,16.16 v2(42.13,16.16)
  Top Layer w0.305: v2(43.37,36.81) U8.45
  Inner2 w0.203: v2(43.37,36.81) 43.96,36.21 43.96,31.02 43.58,30.64 43.58,17.61 v2(42.13,16.16)
D.PC5.FT: length 47.2
  Top Layer w0.203: v2(45.11,19.21) 43.28,19.21 42.21,18.14 41.59,18.14 U.A4.12
  Top Layer w0.305: v2(40.83,37.58) U8.42
  Inner1 w0.203: v2(40.83,37.58) 41.66,38.41 43.73,38.41 44.34,37.8 v2(44.34,36.8)
  Inner2 w0.203: H3.10 34.27,8.83 37.56,12.12 40.61,12.12 45.11,16.62 v2(45.11,19.21) 44.65,19.21 43.96,19.9 43.96,30.56 44.34,30.94 v2(44.34,36.8)
D.PC6.FT: length 49.3
  Top Layer w0.203: U.A4.13 42.88,20 v2(45.09,20)
  Top Layer w0.305: v2(39.56,37.58) U8.40
  Inner1 w0.203: v2(39.56,37.58) 40.85,38.87 44.04,38.87 44.92,37.99 v2(44.92,37.5)
  Inner2 w0.203: v2(44.92,37.5) 44.92,30.84 44.34,30.26 44.34,20.75 v2(45.09,20) 45.46,20 45.72,19.74 45.72,16.7 40.76,11.74 37.71,11.74 36.81,10.84 H3.12
D.PC7: length 43.3
  Top Layer w0.203: U.A4.14 40.61,18.3 v2(40.61,19.06)
  Top Layer w0.305: v2(16.7,33.13) U9.4
  Inner2 w0.203: v2(40.61,19.06) 41.3,19.74 41.3,28.43 37.49,32.24 28.95,32.24 28.72,32.47 28.72,33.99 26.89,35.82 17.83,35.82 16.7,34.69 v2(16.7,33.13)
D.PD0: length 27.5
  Top Layer w0.203: v2(39.01,14.21) 39.01,14.54 U.A4.5
  Top Layer w0.305: v2(39.56,36.88) U8.39
  Inner2 w0.203: v2(39.01,14.21) 39.01,15.55 42.44,18.98 42.44,30.18 40.15,32.47 40.15,33.92 39.56,34.51 v2(39.56,36.88)
D.SWIO: length 29.4
  Top Layer w0.203: v2(61.59,15.75) 62.96,15.75 ; v2(40.69,20.05) 40,19.36 40,18.26 U.A4.15
  Inner1 w0.203: v2(61.59,15.75) 61.59,15.2 58.97,12.58 48.15,12.58 v2(40.69,20.05)
E.A0: length 16.7
  Top Layer w0.203: U.A5.3 32.21,20.12 v2(32.12,20.12)
  Top Layer w0.305: v2(34.48,33.13) U9.32
  Inner1 w0.203: v2(34.48,33.13) 34.48,32.21 32.69,30.41 32.69,20.68 v2(32.12,20.12)
E.A1: length 19.6
  Top Layer w0.203: U.A5.2 32.36,20.84 v2(31.94,20.84)
  Top Layer w0.305: U8.31 v2(34.48,36.88)
  Inner1 w0.203: v2(34.48,36.88) 34.48,35.37 33.83,34.72 33.83,32.09 31.94,30.2 v2(31.94,20.84)
E.A2: length 6.1
  Top Layer w0.203: U9.35 36.84,27.68 36.84,23.21 36.42,22.79 36.01,22.79 U.A5.11
E.A3: length 5.1
  Top Layer w0.203: 33.59,23.62 32.99,24.22 32.99,25.08 34.48,26.57 U9.31
E.A4: length 5.1
  Top Layer w0.203: U.A5.17 32.61,24.04 32.61,25.46 33.21,26.06 U9.29
E.A5: length 5.9
  Top Layer w0.203: U9.25 30.67,24.85 U.A5.19
E.A6: length 6.6
  Top Layer w0.203: U9.23 29.4,25.55 U.A5.20
E.A7: length 5.2
  Top Layer w0.203: U.A5.18 31.94,24.14 U9.27
E.NRST: length 36.6
  Top Layer w0.203: U1.19 51.67,32.76 v2(51.66,32.77) ; R36.2 30.93,22.25 30.93,23.4 29.1,25.23 v2(27.58,25.23)
  Bottom Layer w0.203: v2(51.66,32.77) 51.66,32.16 50.82,31.33 33.29,31.33 27.58,25.61 v2(27.58,25.23)
E.PC0: length 25
  Top Layer w0.203: 35.92,19.59 35.54,19.21 v2(35.54,18.26) ; 35.92,19.59 R38.2 ; 35.92,19.59 U.A5.7
  Top Layer w0.305: v2(25.59,33.13) U9.18
  Inner2 w0.203: v2(25.59,33.13) 25.59,32.4 28.04,29.95 29.87,29.95 30.47,29.34 30.47,23.86 35.54,18.79 v2(35.54,18.26)
E.PC3: length 7.6
  Top Layer w0.203: U9.37 38.29,26.13 37.18,25.02 37.18,22.64 36.88,22.33 36.54,22.33 U.A5.10
E.PC5.FT: length 17.7
  Top Layer w0.203: v2(36.34,23.67) 36.32,23.67 U.A5.12
  Top Layer w0.305: v2(38.29,37.58) U8.38
  Inner1 w0.203: v2(38.29,37.58) 38,37.58 37.79,37.37 37.79,25.12 v2(36.34,23.67)
E.PC6.FT: length 17.1
  Top Layer w0.203: v2(36.34,24.62) 35.73,24.01 35.73,23.65 U.A5.13
  Top Layer w0.305: v2(37.02,37.58) U8.36
  Inner1 w0.203: v2(37.02,37.58) 37.41,37.19 37.41,25.69 v2(36.34,24.62)
E.PC7: length 4.9
  Top Layer w0.203: U.A5.14 35.3,23.78 35.3,24.72 35.75,25.17 U9.33
E.PD0: length 20.7
  Top Layer w0.203: 33.59,20.37 33.37,20.15 33.37,20.08 v2(33.71,19.74)
  Top Layer w0.305: v2(24.32,33.13) U9.16
  Inner2 w0.203: v2(33.71,19.74) 33.71,20.07 30.09,23.69 30.09,29.19 29.71,29.57 27.88,29.57 v2(24.32,33.13)
E.SWIO: length 39.5
  Top Layer w0.203: 34.58,23.62 33.6,24.6 v2(33.6,24.62) ; v2(60.83,16.25) 62.96,16.25
  Inner1 w0.203: v2(60.83,16.25) 60.83,14.97 58.82,12.96 48.38,12.96 41.37,19.97 41.37,20.35 40.91,20.81 v2(40.53,20.81)
  Bottom Layer w0.203: v2(40.53,20.81) 39.24,22.11 38.17,22.11 37.03,23.25 37.03,24.95 36.67,25.31 35.12,25.31 34.44,24.62 v2(33.6,24.62)
EN: length 99.6
  Top Layer w0.203: v2(48.38,26.37) 44.88,26.37 44.64,26.61 U9.47 ; 59.29,7.7 59.29,8.51 59.33,8.54 59.29,8.58 C20.1 60.5,9.82 v2(60.5,9.84) ; 59.29,7.7 58.69,7.09 v2(57.53,7.09) ; 59.29,7.7 59.29,6.47 SW1.2 SW1.1 ; U1.8 v2(58.19,37.73) ; C1.1 62.33,23.78 62.2,23.91 ; 62.2,23.91 62.48,24.19 v2(62.48,25.08) ; 62.2,23.91 61.11,23.91 R4.1
  Inner1 w0.203: v2(57.53,7.09) 54.98,4.55 47.5,4.55 46.63,5.42 45.03,5.42 42.97,7.48 35.52,7.48 H3.9 ; v2(61.64,30.18) 62.33,30.18 63.01,29.5 63.01,28.28 63.39,27.9 63.39,25.08 ; 63.39,25.08 v2(62.48,25.08) ; 63.39,25.08 67.48,20.99 67.48,13.39 63.93,9.84 v2(60.5,9.84)
  Inner2 w0.203: v2(48.38,26.37) 50.21,26.37 52.73,28.89 56.61,28.89 57.91,30.18 59.28,30.18 59.81,30.72 ; v2(61.64,30.18) 60.35,30.18 59.81,30.72 ; 59.81,30.72 59.81,36.1 v2(58.19,37.73)
GPIO9/BOOT: length 55.5
  Top Layer w0.203: v2(62.4,28.96) 61.81,29.56 U1.23 52.18,29.56 v2(52.03,29.71) ; U9.49 v2(47.27,27.86) ; SW2.3 SW2.4 66.67,6.67 66.34,7 63.3,7 62.17,8.12 62.17,11.11 R17.1 v2(62.2,12.2)
  Inner1 w0.203: v2(62.4,28.96) 61.72,28.28 61.72,24.93 62.6,24.04 63.75,24.04 67.05,20.73 67.05,13.57 66.44,12.96 62.96,12.96 v2(62.2,12.2) ; v2(52.03,29.71) 50.17,27.86 v2(47.27,27.86)
IO0: length 106.9
  Top Layer w0.203: U9.45 43.37,29.21 43.66,29.5 46.93,29.5 v2(47.93,28.51) ; v2(56.81,38.37) 56.8,38.36 U1.12
  Inner1 w0.203: v2(62.56,37.65) 61.83,38.37 v2(56.81,38.37)
  Inner2 w0.203: H3.1 25.76,4.58 44.19,4.58 44.8,3.97 58.97,3.97 67.66,12.66 67.66,21.12 63.55,25.23 63.55,26.91 63.01,27.44 63.01,37.19 v2(62.56,37.65) ; v2(56.81,38.37) 56.23,37.79 56.23,30.48 55.02,29.27 52.57,29.27 51.81,28.51 v2(47.93,28.51)
IO2: length 33.4
  Top Layer w0.203: U1.5 v2(60.59,37.42) ; U9.43 41.98,27.74 41.98,26.22 42.44,25.76 v2(46.78,25.76) 47.47,25.76 47.87,25.36 R18.1
  Inner1 w0.203: v2(60.59,37.42) 59.81,36.65 59.81,30.64 58.29,29.12 53.94,29.12 53.11,28.28 53.11,26.68 52.19,25.76 v2(46.78,25.76)
IO3: length 102.9
  Top Layer w0.203: 59.79,40.41 U1.6 ; v2(45.56,25.15) 41.35,25.15 40.83,25.68 U9.41
  Inner2 w0.203: 61.08,28.51 62.6,30.03 62.6,36.28 62.07,36.81 60.27,36.81 59.79,37.29 v2(59.79,40.41) ; 61.08,28.51 61.11,28.51 63.16,26.45 63.16,25.08 67.28,20.96 67.28,12.89 58.75,4.35 44.95,4.35 44.34,4.96 27.92,4.96 H3.3 ; 61.08,28.51 52.88,28.51 49.53,25.15 v2(45.56,25.15)
RXD0: length 115.1
  Top Layer w0.203: v2(50.36,25.08) 49.07,26.38 49.07,28.81 47.62,30.26 47.62,31.1 47.11,31.61 U9.50 ; U1.30 v2(59.79,25.41) ; v2(8.45,11.09) 7.57,11.09 6.83,10.35 FPC2.3
  Inner2 w0.203: v2(50.36,25.08) 50.36,24.54 50.59,24.32 51.66,24.32 54.25,26.91 58.9,26.91 59.79,26.02 v2(59.79,25.41) 59.79,24.49 61.41,22.87 64.31,22.87 66.52,20.66 66.52,13.34 58.29,5.11 45.26,5.11 44.65,5.72 44.65,9.61 43.81,10.45 39.85,10.45 39.35,9.95 H3.14
  Bottom Layer w0.203: H3.14 39.01,8.77 37.79,7.55 35.89,7.55 35.5,7.93 35.5,10.45 33.9,12.05 31.77,12.05 31.02,11.29 22.41,11.29 21.56,10.45 18.44,10.45 17.59,11.29 8.66,11.29 v2(8.45,11.09)
SCL: length 118.7
  Top Layer w0.203: FPC2.4 7.17,9.85 v2(7.23,9.91) ; U.A3.9 30.68,15.17 v2(31.31,15.17) ; U.A2.9 25.3,20.97 25.98,20.97 v2(26.01,20.93) ; v2(36.42,21.04) 36.22,20.84 35.81,20.84 U.A5.9 ; v2(20.8,15.33) 20.15,15.33 U.A1.9 ; 40.62,15.62 40.99,15.25 41.63,15.25 v2(41.91,15.52) ; 51.74,30.87 52.25,30.36 v2(53.44,30.36) 54.88,30.36 U1.22
  Top Layer w0.305: v2(42.1,32.98) U9.44
  Inner1 w0.203: 42.06,33.13 42.06,33.09 ; 42.06,33.09 42.06,33.02 v2(42.1,32.98) 42.1,31.44 ; 42.06,33.09 42.04,33.07 ; v2(20.8,15.33) 21.64,15.33 22.47,16.16 22.47,20.12 23.28,20.93 v2(26.01,20.93) ; 42.1,31.44 43.19,30.36 v2(53.44,30.36) ; 42.1,31.44 41.62,30.97 40.78,30.97 39.92,30.11 39.92,23.25 39.3,22.63 38.01,22.63 v2(36.42,21.04) 38.32,21.04 39.31,20.05 39.31,18.11 v2(41.91,15.52) 43,15.52 v2(44.42,14.1) ; v2(35.35,11.89) 37.03,11.89 38.09,10.83 v2(38.09,9.69)
  Inner2 w0.203: H3.7 33.01,7.51 37.67,7.51 38.09,7.93 v2(38.09,9.69) 39.77,11.36 40.91,11.36 43.66,14.1 v2(44.42,14.1) ; v2(7.23,9.91) 20.27,9.91 23.24,12.89 ; 23.24,12.89 v2(20.8,15.33) ; 23.24,12.89 28.88,12.89 29.56,13.57 29.56,14.49 30.25,15.17 v2(31.31,15.17) 32.08,15.17 v2(35.35,11.89)
SDA: length 110.8
  Top Layer w0.203: v2(7.92,10.45) 7.92,9.84 7.43,9.35 FPC2.5 ; U.A4.8 40.96,14.71 v2(41.22,14.71) ; v2(25.52,20.35) 25.34,20.35 U.A2.8 ; v2(30.6,14.53) 30.6,14.69 29.95,15.34 ; U.A5.8 35.76,20.32 v2(35.96,20.32) ; U1.16 v2(53.41,35.16) 53.39,35.14 R19.1 ; v2(20.3,14.8) 20.11,14.8 U.A1.8
  Top Layer w0.305: v2(40.83,32.98) U9.42
  Inner1 w0.203: 21.03,14.07 21.03,14.15 22.86,15.98 22.86,19.97 23.24,20.35 v2(25.52,20.35) ; 21.03,14.07 v2(20.3,14.8) ; 21.03,14.07 21.03,12.43 ; v2(41.22,14.71) 40.08,13.57 36.04,13.57 ; v2(30.6,14.53) 28.46,14.53 25.75,11.82 ; 29.41,11.82 29.41,11.29 v2(27.88,9.76) ; 29.41,11.82 32.27,11.82 33.3,12.85 35.31,12.85 36.04,13.57 ; 29.41,11.82 25.75,11.82 ; 25.75,11.82 21.64,11.82 21.03,12.43 ; v2(53.41,35.16) 51.38,35.16 50.06,33.84 41.69,33.84 v2(40.83,32.98) 40.83,31.55 39.54,30.26 39.54,23.48 39.17,23.1 37.95,23.1 36.57,21.72 36.04,21.72 35.73,21.42 35.73,20.55 v2(35.96,20.32) 36.19,20.09 36.19,15.86 35.43,15.09 35.43,14.18 36.04,13.57 ; 21.03,12.43 21.03,11.29 20.19,10.45 v2(7.92,10.45)
  Inner2 w0.203: H3.5 27.88,7.54 v2(27.88,9.76)
TXD0: length 113.9
  Top Layer w0.203: v2(51.2,25.08) 49.53,26.74 49.53,29.09 48,30.62 48,31.33 46.25,33.08 44.88,33.08 44.64,32.84 U9.48 ; U1.31 60.59,26.08 v2(60.57,26.07) ; v2(7.46,11.74) 6.57,10.85 FPC2.2
  Inner2 w0.203: 41.89,8.77 43.6,8.77 44.24,8.13 44.24,5.59 45.11,4.73 58.52,4.73 66.9,13.11 66.9,20.81 64.46,23.25 61.64,23.25 60.57,24.32 v2(60.57,26.07) 58.52,28.13 54.25,28.13 v2(51.2,25.08)
  Bottom Layer w0.203: v2(7.46,11.74) 7.54,11.67 17.75,11.67 18.59,10.83 21.41,10.83 22.25,11.67 30.7,11.67 31.47,12.43 34.06,12.43 35.2,11.29 39.38,11.29 41.89,8.77
USB_D+: length 2.9
  Top Layer w0.203: U1.27 57.39,24.91 arc(57.41,24.85) R8.1
USB_D-: length 2.9
  Top Layer w0.203: U1.26 56.59,24.94 arc(56.55,24.86) R7.1
$1N2210: length 27.4
  Top Layer w0.203: 48.38,8.86 48.63,8.86 arc(49.06,8.68) 49.24,8.25 ; 49.24,8.25 49.24,7.39 arc(49.24,7.38) USB1.5 49.25,6.38 arc(49.33,6.18) 49.53,6.1 49.98,6.1 arc(50.17,6.18) 50.25,6.38 USB1.7 ; 49.24,8.25 v2(49.24,10.37) ; R7.2 56.47,22.6
  Bottom Layer w0.203: v2(56.47,22.6) 56.47,21.9 arc(56.52,21.78) 56.65,21.72 arc(56.75,21.68) 56.8,21.57 56.8,14.69 arc(56.25,13.35) 54.91,12.8 50.63,12.8 arc(49.66,12.4) 49.26,11.43 49.26,10.39 arc(49.25,10.38) v2(49.24,10.37)
$1N2216: length 27.2
  Top Layer w0.203: 49.74,8.33 49.74,7.39 arc(49.74,7.38) USB1.6 ; 49.74,8.33 v2(49.74,9.69) arc(49.75,9.68) 49.75,9.67 49.75,9.38 arc(49.93,8.95) 50.36,8.77 arc(50.57,8.71) 50.71,8.56 arc(50.74,8.47) 50.75,8.38 50.75,8.32 ; 49.74,8.33 arc(49.82,8.53) 50.03,8.62 50.46,8.62 arc(50.6,8.58) 50.71,8.48 arc(50.74,8.4) 50.75,8.32 ; v2(57.5,22.6) 57.5,23.91 57.45,23.96 ; 50.75,8.32 USB1.8
  Bottom Layer w0.203: v2(57.5,22.6) 57.5,21.9 arc(57.45,21.78) 57.32,21.72 arc(57.22,21.68) 57.17,21.57 57.17,14.23 arc(56.64,12.96) 55.37,12.43 50.88,12.43 arc(50.1,12.11) 49.78,11.33 49.78,9.73 arc(49.77,9.7) v2(49.74,9.69)
$1N5190: length 5.3
  Top Layer w0.203: 14.19,14.21 15.41,15.42 ; 15.41,15.42 16.4,15.42 16.88,15.9 ; 15.41,15.42 14.19,15.42 R24.1
$1N5199: length 1.9
  Top Layer w0.203: 22.4,13 21.8,13.6 21.8,13.81 R26.1
$1N5603: length 2.6
  Top Layer w0.203: R28.1 R27.1 21.08,21.88 21.7,21.88 U.A2.1
$1N5612: length 1.1
  Top Layer w0.203: R29.1 27.1,20.63 27.1,20.7
$1N6016: length 5.3
  Top Layer w0.203: U.A3.1 26.78,15.42 25.79,15.42 ; 25.79,15.42 24.58,14.21 ; 25.79,15.42 24.58,15.42 24.09,15.91
$1N6025: length 1.9
  Top Layer w0.203: 32.78,13 32.18,13.6 32.18,13.81 31.59,14.41
$1N6429: length 5.3
  Top Layer w0.203: U.A4.1 37.16,15.42 36.17,15.42 ; 36.17,15.42 34.96,14.21 ; 36.17,15.42 34.96,15.42 34.47,15.91
$1N6438: length 1.9
  Top Layer w0.203: 41.97,14.41 42.57,13.81 42.57,13.6 43.17,13
$1N6842: length 2.5
  Top Layer w0.203: R37.1 R36.1 31.78,21.88 32.08,21.88 U.A5.1
$1N6851: length 2.1
  Top Layer w0.203: R38.1 37.5,19.53 37.5,20.3 LED6.1
$1N20024: length 8.2
  Top Layer w0.203: 59.24,20.81 58.9,20.81 v2(58.52,21.19) ; 59.24,20.81 58.97,20.55 U14.3 ; 59.24,20.81 R44.2 ; Q14.1 54.25,22.46 v2(54.25,21.42)
  Inner1 w0.203: v2(58.52,21.19) 54.48,21.19 v2(54.25,21.42)
$1N20025: length 1.7
  Top Layer w0.203: U14.2 59.76,19.9 R45.2

## Copper pours and planes (outline as drawn; the poured copper is in the pictures)
+3.3V on Top Layer: -4.88,46.79 69.19,46.79 69.19,-3.57 -4.88,-3.57
+3.3V on Top Layer: 9.41,9.4 11.31,9.4 11.31,5.5 9.41,5.5
+3.3V on Inner1: 2.74,22.18 11.35,22.18 11.35,15.02 2.74,15.02
+3.3V.LDO on Top Layer: 48.62,21.15 53.13,21.15 54.83,19.44 56.38,19.44 56.77,19.05 56.77,18.83 56.61,18.68 55.97,18.68 55.51,18.22 55.51,17.82 54.9,17.22 54.15,17.22 53.44,17.92 52.65,17.92 52.64,17.92 52.64,18.99 52.12,19.51 50.19,19.51 48.62,21.08
+5V on Top Layer: 15.12,9.35 17.02,9.35 17.02,5.45 15.12,5.45
+5V on Top Layer: 52.19,16.47 52.99,16.47 53.42,16.02 55.5,16.02 55.5,14.76 55.62,14.64 56.69,14.64 56.8,14.75 56.8,15.59 57.15,15.93 57.41,15.67 57.41,11.88 57.11,11.59 55.12,13.59 51.57,13.59 51.57,14.93 52.19,15.55
+5V on Inner1: 53.34,14.41 54.78,14.41 55.09,14.71 55.09,16.02 55.01,16.1 53.27,16.1 52.95,15.78 52.95,14.79
+5V on Inner1: 36.81,5.96 38.3,4.48 35.32,4.48
+5V on Inner2: 42.11,37.65 43.38,37.65 44.22,38.49 42.95,38.49
+5V on Inner2: 52.42,15.94 54.86,15.94 54.86,14.41 52.42,14.41
GND on Top Layer: 26.29,27.53 28.51,27.53 28.51,25.76 26.29,25.76
GND on Top Layer: 12.26,9.4 14.16,9.4 14.16,5.5 12.26,5.5
GND on Top Layer: 42.14,22.63 48.6,22.63 48.69,22.72 48.69,24.32 48.53,24.47 41.3,24.47 39.77,25.99 38.71,25.99 37.49,24.77 37.49,22.95 39.14,21.3 40.47,22.64 42.14,22.64
GND on Top Layer: 38.98,7.5 42.92,7.5 43.2,7.78 43.2,9.84 44.36,9.84 45.74,8.47 54.4,8.47 55.62,9.69 58.26,9.69 58.52,9.43 58.52,7.17 60.04,5.65 69.64,5.65 69.79,5.49 69.79,-0.6 68.96,-1.44 39.16,-1.44 38.98,-1.26
GND on Top Layer: 4.49,39.17 5.33,38.34 6.62,38.34 7.04,37.92 7.04,37.1 5.16,37.1 4.49,36.43 3.27,36.43 2.47,37.24 2.47,38.72 2.92,39.17
GND on Top Layer: 26.48,40.13 28.51,40.13 28.51,26.83 26.48,26.83
GND on Top Layer: 47.01,20.05 47.59,20.08 48.52,19.15 50.92,19.15 52.04,18.03 52.04,17.23 51.59,16.78 51.59,15.56 50.98,14.95 50.98,13.81 50.75,13.58 48.41,13.58 48.08,13.92 48.08,17.76 47.01,18.83
GND on Top Layer: 2.47,17.56 4.2,17.56 5.54,18.9 7.77,18.9 8.38,18.3 8.38,14.03 6.51,12.16 6.51,11.22 5.24,11.22 5.04,11.02 5.04,6.24 6.09,5.19 11.99,5.19 12.77,5.96 14.16,5.96 12.54,4.35 3.87,4.35 2.06,6.16 2.06,15.16 2.49,15.58 2.49,17.54
GND on Top Layer: 26.06,30.6 27.12,30.6 27.12,28.87 26.06,28.87
GND on Top Layer: 66.9,21.45 61.92,21.45 61.54,21.07 60.97,21.07 60.7,20.81 60.7,19.85 57.78,16.93 55.63,16.93 56.24,16.33 58.76,16.33 60.8,18.37 61.49,18.37 61.72,18.6 63.94,18.6 64.38,18.15 64.38,12.96 66.29,12.96 66.9,13.57
GND on Bottom Layer: -0.77,43.44 72.46,43.44 72.46,-1.14 -0.77,-1.14
GND on Inner2: 58.29,26.6 59.05,25.84 59.05,24.54 61.18,22.41 64,22.41 66.06,20.35 66.06,13.72 57.91,5.57 45.56,5.57 45.11,6.03 45.11,12.05 48.15,15.09 48.15,20.12 54.63,26.6
VBUS_USB on Top Layer: 52.93,11.13 52.93,9.35 52.13,8.54 52.13,7.65 52.67,7.1 52.67,8.17 53.12,8.62 53.83,8.62 54.13,8.92 54.13,11.98 52.09,11.98

Small or netless copper shapes (teardrops, artwork), in the pictures only: 3 on Top Layer, 2 on Bottom Layer

## Text on the board
Document Layer: C. G. #Dieu de l'élec / IOX-77 Devboard | Opensource is love | 10.12.2025
Top Solder Mask Layer: BOOT | RST
Top Silkscreen Layer: JLCJLCJLCJLC | 3.3V | GND | 5V | SW | USB C
